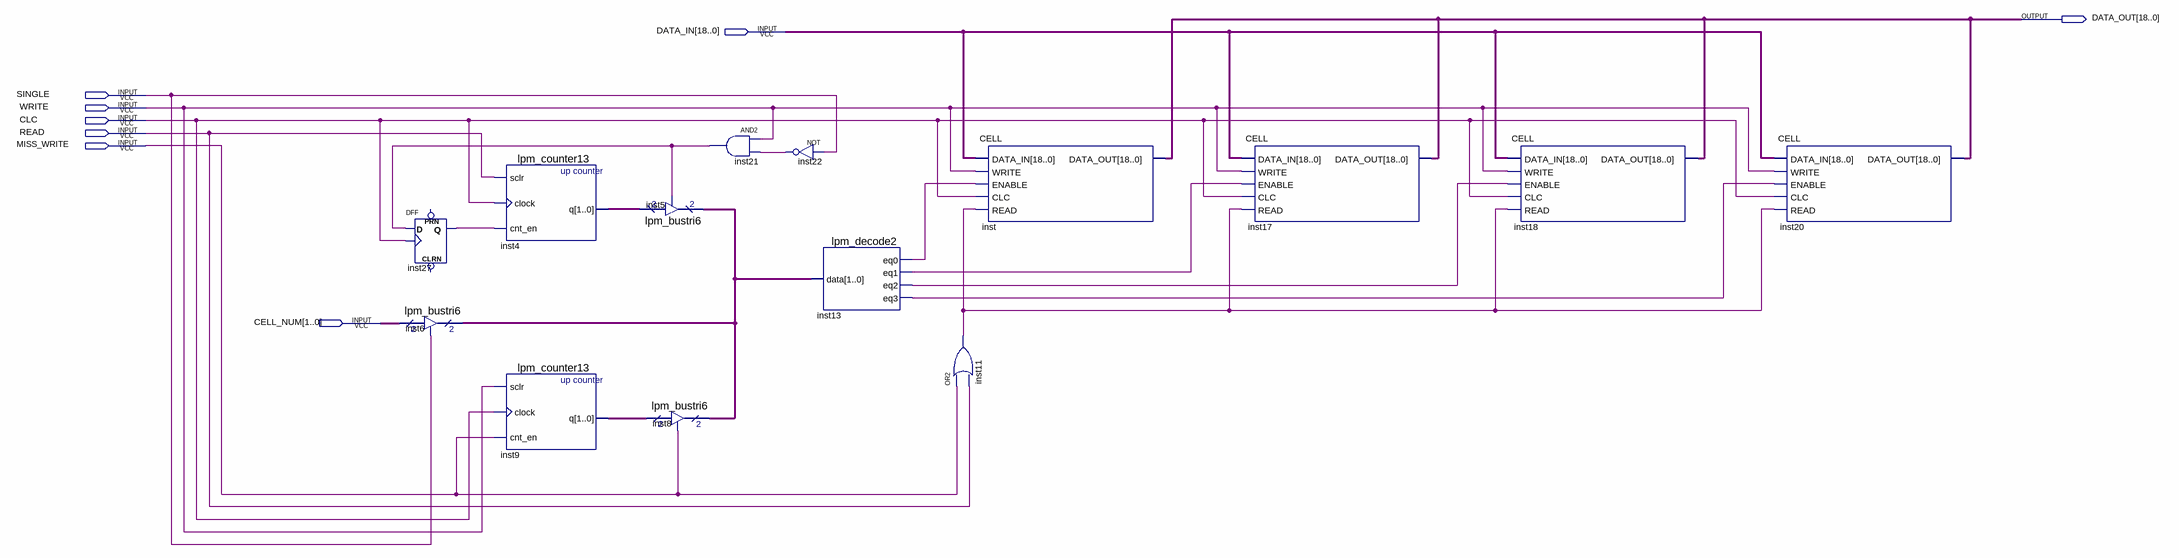
[diagram p0: schematic sheet]
// Quartus schematic ROW.bdf as structural Verilog: 14 symbols, 8 pins
module ROW (
  input  [18:0] DATA_IN,
  input  SINGLE,
  input  WRITE,
  input  CLC,
  input  READ,
  input  MISS_WRITE,
  input  [1:0] CELL_NUM,
  output [18:0] DATA_OUT
);

  wire inst11_out, inst13_eq0, inst13_eq1, inst13_eq2, inst13_eq3, inst21_out, inst22_out, inst27_q;
  wire [1:0] inst4_q, inst6_tridata, inst9_q;

  DFF inst27 (.CLK(CLC), .D(inst21_out), .Q(inst27_q));  // open: CLRN, PRN
  lpm_bustri6 inst6 (.enabledt(SINGLE), .data(CELL_NUM), .tridata(inst6_tridata));
  lpm_counter13 inst4 (.sclr(READ), .clock(CLC), .cnt_en(inst27_q), .q(inst4_q));
  lpm_counter13 inst9 (.sclr(WRITE), .clock(CLC), .cnt_en(MISS_WRITE), .q(inst9_q));
  lpm_bustri6 inst5 (.enabledt(inst21_out), .data(inst4_q), .tridata(inst6_tridata));
  lpm_bustri6 inst8 (.enabledt(MISS_WRITE), .data(inst9_q), .tridata(inst6_tridata));
  and inst21 (inst21_out, WRITE, inst22_out);
  not inst22 (inst22_out, SINGLE);
  lpm_decode2 inst13 (.data(inst6_tridata), .eq0(inst13_eq0), .eq1(inst13_eq1), .eq2(inst13_eq2), .eq3(inst13_eq3));
  or inst11 (inst11_out, MISS_WRITE, READ);
  CELL inst (.DATA_IN(DATA_IN), .WRITE(WRITE), .ENABLE(inst13_eq0), .CLC(CLC), .READ(inst11_out), .DATA_OUT(DATA_OUT));
  CELL inst17 (
    .DATA_IN(DATA_IN), .WRITE(WRITE), .ENABLE(inst13_eq1), .CLC(CLC), .READ(inst11_out), .DATA_OUT(DATA_OUT));
  CELL inst18 (
    .DATA_IN(DATA_IN), .WRITE(WRITE), .ENABLE(inst13_eq2), .CLC(CLC), .READ(inst11_out), .DATA_OUT(DATA_OUT));
  CELL inst20 (
    .DATA_IN(DATA_IN), .WRITE(WRITE), .ENABLE(inst13_eq3), .CLC(CLC), .READ(inst11_out), .DATA_OUT(DATA_OUT));
endmodule
